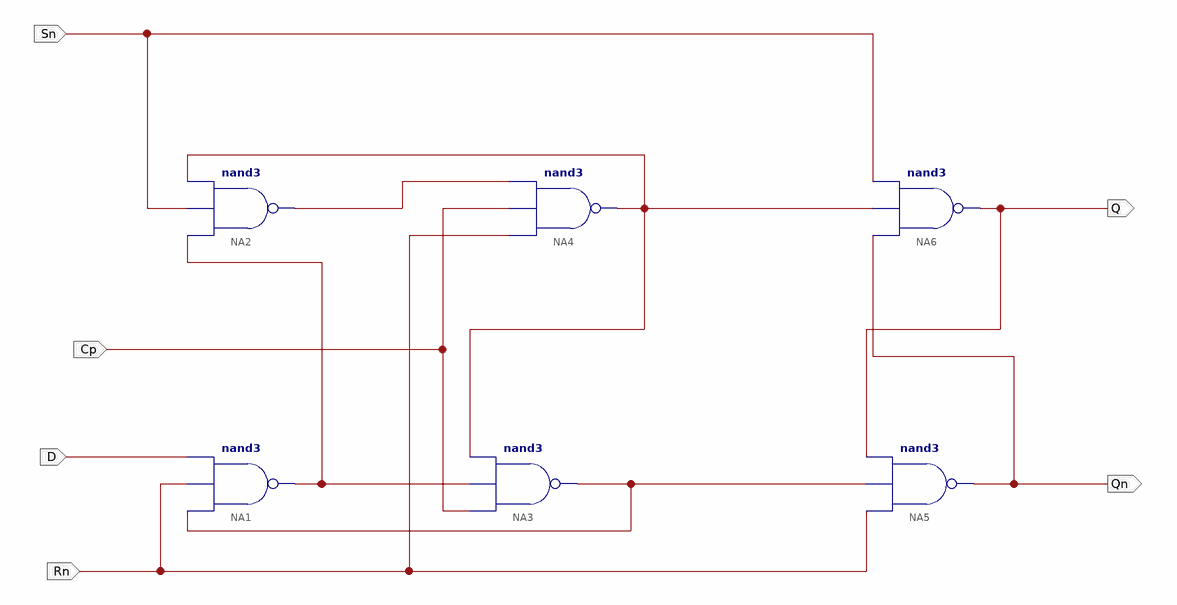
[diagram p0: schematic sheet 1]
// Xilinx ISE schematic MB_DFF.sch (kintex7) as structural Verilog: 6 symbols, 6 ports
module MB_DFF (
  input  Sn,
  input  Rn,
  input  D,
  input  Cp,
  output Q,
  output Qn
);

  wire XLXN_3, XLXN_5, XLXN_6, XLXN_11;

  nand NA2 (XLXN_6, XLXN_5, Sn, XLXN_3);
  nand NA1 (XLXN_5, XLXN_11, Rn, D);
  nand NA6 (Q, Qn, XLXN_3, Sn);
  nand NA5 (Qn, Rn, XLXN_11, Q);
  nand NA4 (XLXN_3, Rn, Cp, XLXN_6);
  nand NA3 (XLXN_11, Cp, XLXN_5, XLXN_3);
endmodule
